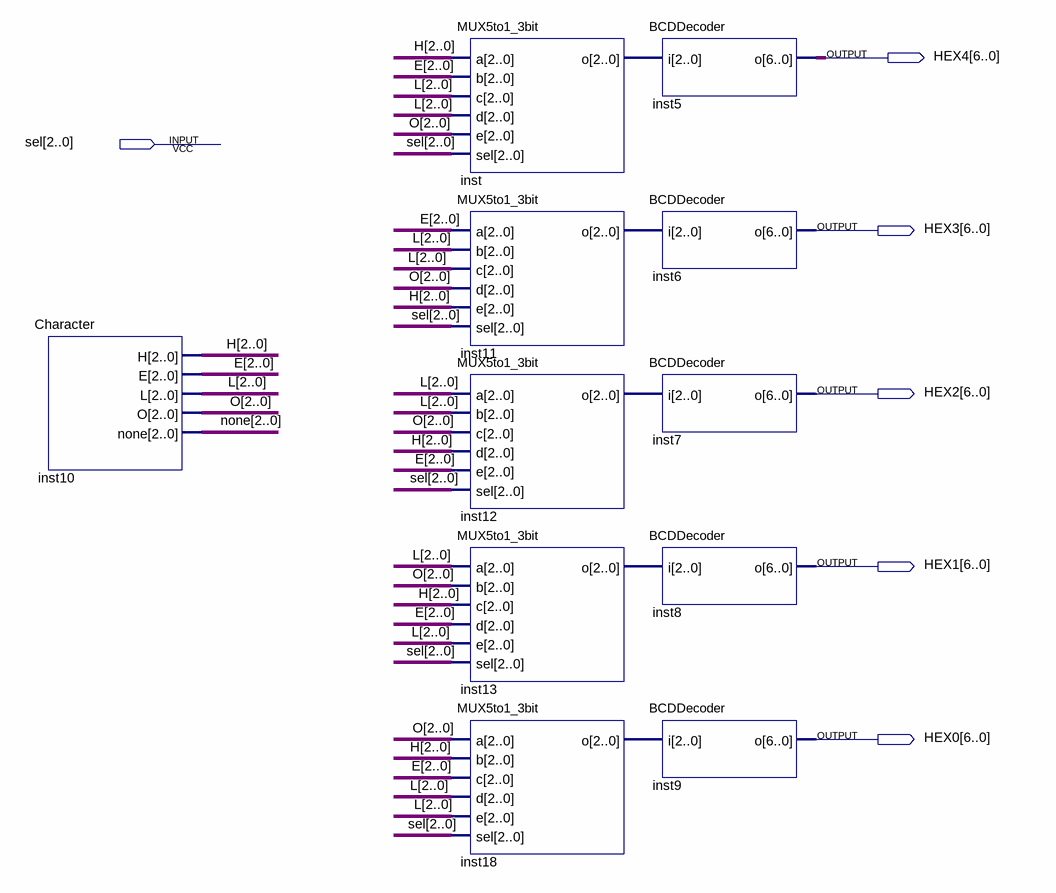
[diagram p0: schematic sheet]
// Quartus schematic hex.bdf as structural Verilog: 11 symbols, 6 pins
module hex (
  input  [2:0] sel,
  output [6:0] HEX4,
  output [6:0] HEX3,
  output [6:0] HEX2,
  output [6:0] HEX1,
  output [6:0] HEX0
);

  wire [2:0] E, H, inst11_o, inst12_o, inst13_o, inst18_o, inst_o, L, none, O;

  Character inst10 (.H(H), .E(E), .L(L), .O(O), .none(none));
  MUX5to1_3bit inst (.a(H), .b(E), .c(L), .d(L), .e(O), .sel(sel), .o(inst_o));
  MUX5to1_3bit inst11 (.a(E), .b(L), .c(L), .d(O), .e(H), .sel(sel), .o(inst11_o));
  MUX5to1_3bit inst12 (.a(L), .b(L), .c(O), .d(H), .e(E), .sel(sel), .o(inst12_o));
  MUX5to1_3bit inst13 (.a(L), .b(O), .c(H), .d(E), .e(L), .sel(sel), .o(inst13_o));
  MUX5to1_3bit inst18 (.a(O), .b(H), .c(E), .d(L), .e(L), .sel(sel), .o(inst18_o));
  BCDDecoder inst5 (.i(inst_o), .o(HEX4));
  BCDDecoder inst6 (.i(inst11_o), .o(HEX3));
  BCDDecoder inst7 (.i(inst12_o), .o(HEX2));
  BCDDecoder inst8 (.i(inst13_o), .o(HEX1));
  BCDDecoder inst9 (.i(inst18_o), .o(HEX0));
endmodule
